# Altium schematic sheet P02 Block.SchDoc
size 297 x 209 mm
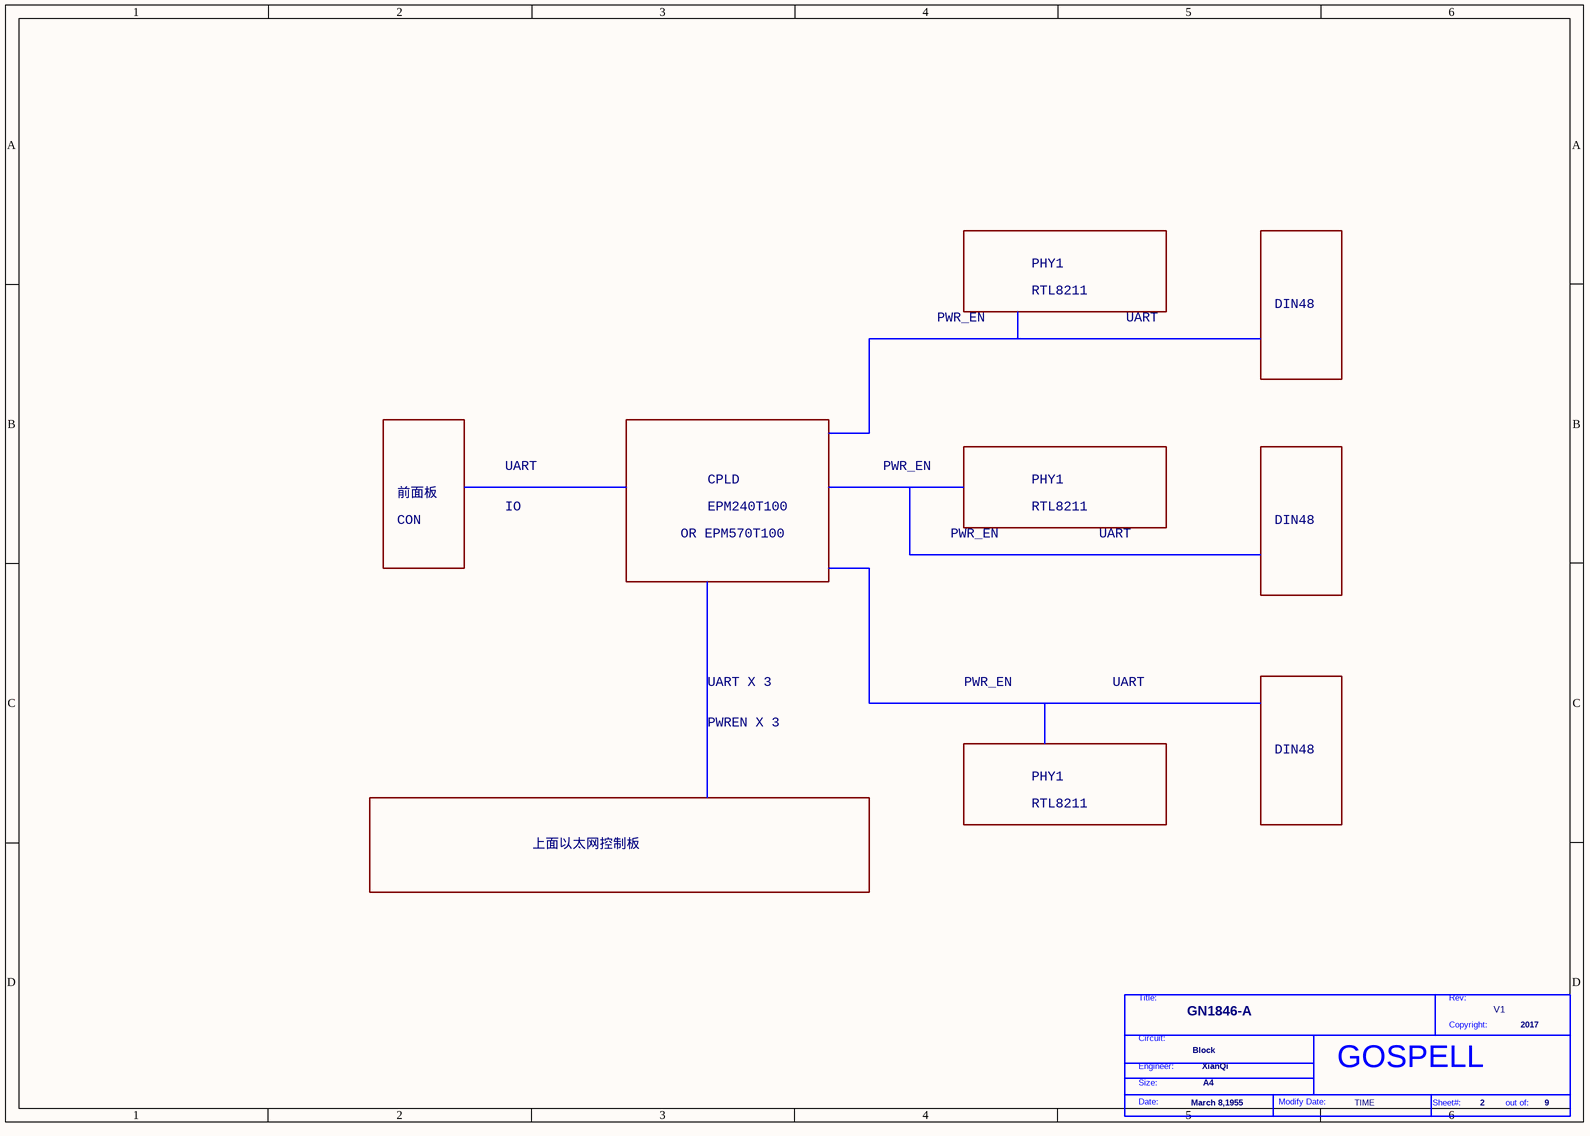
[diagram p0: P02 Block.SchDoc]

## Parts
*  Doc: Block  Page Count: 9  Page Number: 2  Page Create Date: March 8,1955  Page Size: A4  RevCode: V1  Title: GN1846-A  Copyright: 2017  Engineer: XianQi  Page Modify Date: TIME  (hidden comment: GOSPELL)  (graphical)

## Notes on the sheet
- PHY1
- PWR_EN
- RTL8211
- UART
- DIN48
- 前面板
- CON
- IO
- OR EPM570T100
- CPLD
- EPM240T100
- UART X 3
- PWREN X 3
- 上面以太网控制板
- (in symbol GOSPELL) Title:; Rev:; Copyright:; Circuit:; Engineer:; Size:; Date:; Modify Date:; Sheet#:; out of:

## Library data of the parts
* = GOSPELL: Cage Code: 2017; Schematic Page Count: 9; Schematic Page Number: 2